# Altium project ESP32_PM.PrjPcb
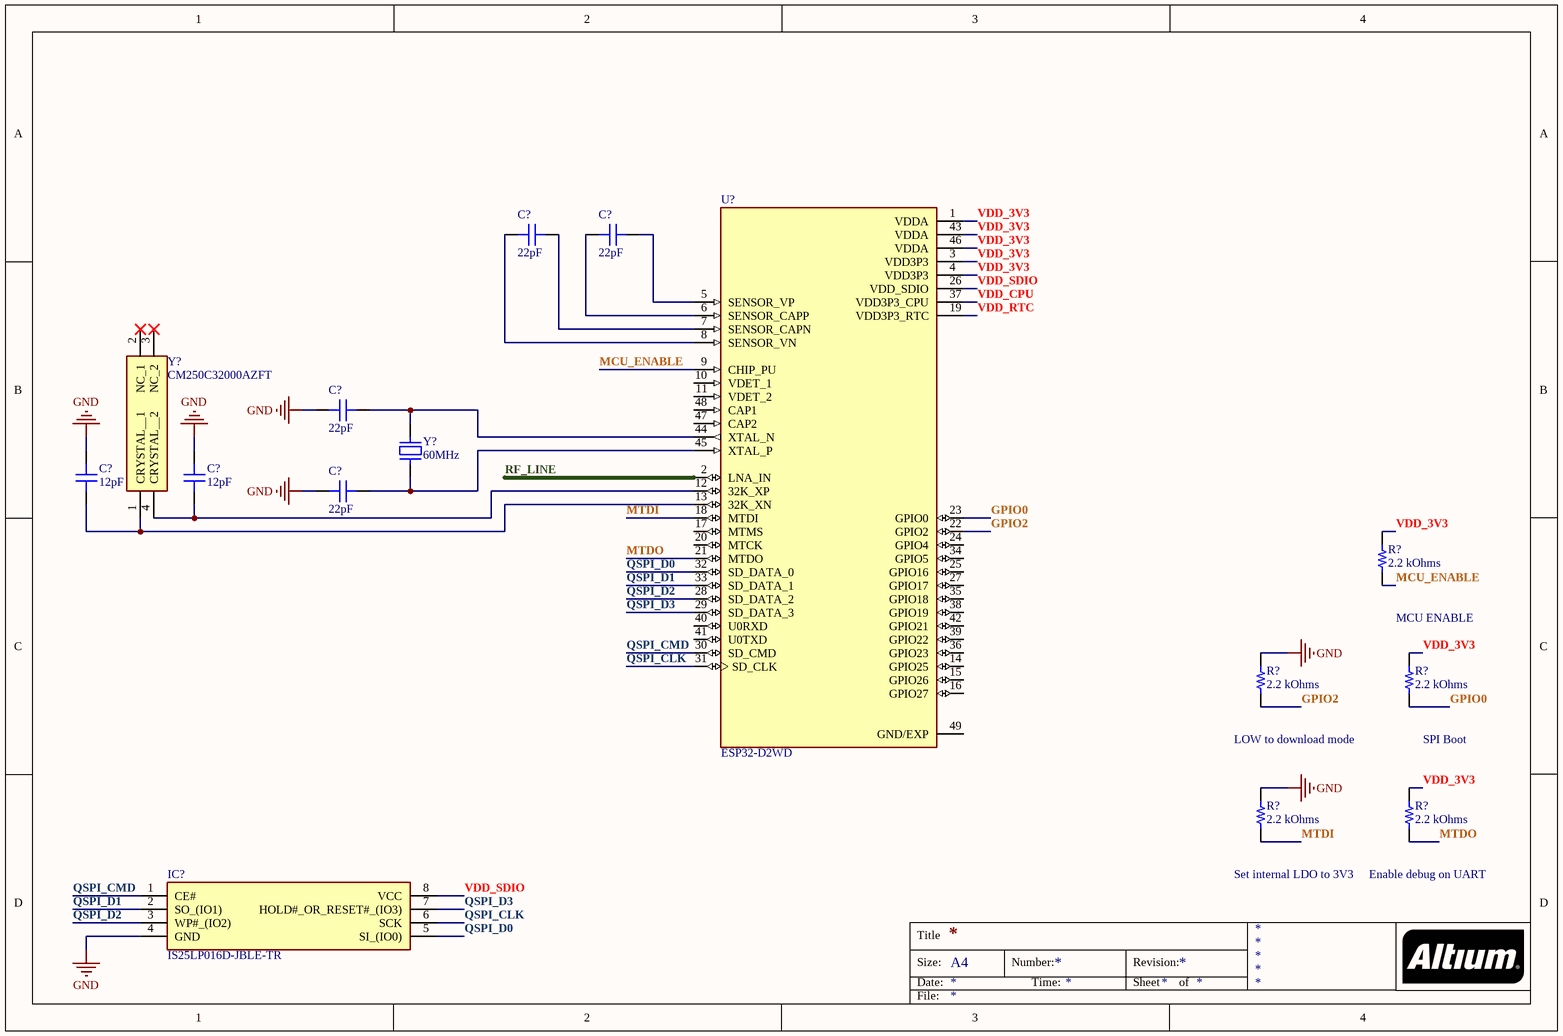
[diagram p0: Schematic.SchDoc]
Autor: Carlos Lecaro G.
1 sheet, 15 parts. Net scope: global (net labels, ports and power ports of the same name join across sheets).

## Sheet Schematic.SchDoc
size A4

### Parts
(Parts that share a designator on the sheet are numbered #1, #2 ... from top to bottom, then left to right.)
C?#1  22pF  [CAP 0603_1608]
C?#2  22pF  [CAP 0603_1608]
C?#3  22pF  [CAP 0603_1608]
C?#4  12pF  [CAP 0603_1608]
C?#5  12pF  [CAP 0603_1608]
C?#6  22pF  [CAP 0603_1608]
IC?  IS25LP016D-JBLE-TR  [SOIC127P790X216-8N]
R?#1  2.2 kOhms  [RES 0603_1608]
R?#2  2.2 kOhms  [RES 0603_1608]
R?#3  2.2 kOhms  [RES 0603_1608]
R?#4  2.2 kOhms  [RES 0603_1608]
R?#5  2.2 kOhms  [RES 0603_1608]
U?  ESP32-D2WD  [QFN35P500X500X90-49N]
Y?#1  60MHz  [TXC 9C]
Y?#2  CM250C32000AZFT  [CM250C32000AZFT]

### Nets
GND: C?#3.1 C?#4.2 C?#5.2 C?#6.1 IC?.4(GND) R?#2.2 R?#4.2
GPIO0: R?#3.1 U?.23(GPIO0)
GPIO2: R?#2.1 U?.22(GPIO2)
MCU_ENABLE: R?#1.1 U?.9(CHIP_PU)
MTDI: R?#4.1 U?.18(MTDI)
MTDO: R?#5.1 U?.21(MTDO)
QSPI_CLK: IC?.6(SCK) U?.31(SD_CLK)
QSPI_CMD: IC?.1(CE#) U?.30(SD_CMD)
QSPI_D0: IC?.5(SI_(IO0)) U?.32(SD_DATA_0)
QSPI_D1: IC?.2(SO_(IO1)) U?.33(SD_DATA_1)
QSPI_D2: IC?.3(WP#_(IO2)) U?.28(SD_DATA_2)
QSPI_D3: IC?.7(HOLD#_OR_RESET#_(IO3)) U?.29(SD_DATA_3)
RF_LINE: U?.2(LNA_IN)
VDD_3V3: R?#1.2 R?#3.2 R?#5.2 U?.1(VDDA) U?.3(VDD3P3) U?.4(VDD3P3) U?.43(VDDA) U?.46(VDDA)
VDD_CPU: U?.37(VDD3P3_CPU)
VDD_RTC: U?.19(VDD3P3_RTC)
VDD_SDIO: IC?.8(VCC) U?.26(VDD_SDIO)
NetC?#1_1: C?#1.1 U?.7(SENSOR_CAPN)
NetC?#1_2: C?#1.2 U?.8(SENSOR_VN)
NetC?#2_1: C?#2.1 U?.5(SENSOR_VP)
NetC?#2_2: C?#2.2 U?.6(SENSOR_CAPP)
NetC?#3_2: C?#3.2 U?.44(XTAL_N) Y?#1.2
NetC?#4_1: C?#4.1 U?.13(32K_XN) Y?#2.1(CRYSTAL__1)
NetC?#5_1: C?#5.1 U?.12(32K_XP) Y?#2.4(CRYSTAL__2)
NetC?#6_2: C?#6.2 U?.45(XTAL_P) Y?#1.1

Not connected (* = marked no-connect by the designer): U? 10(VDET_1) 11(VDET_2) 14(GPIO25) 15(GPIO26) 16(GPIO27) 17(MTMS) 20(MTCK) 24(GPIO4) 25(GPIO16) 27(GPIO17) 34(GPIO5) 35(GPIO18) 36(GPIO23) 38(GPIO19) 39(GPIO22) 40(U0RXD) 41(U0TXD) 42(GPIO21) 47(CAP2) 48(CAP1) 49(GND/EXP); Y?#2 2(NC_1)* 3(NC_2)*

### Notes on the sheet
- (near R?#3) MCU ENABLE
- (near R?#2) LOW to download mode
- (near R?#3) SPI Boot
- (near R?#4) Set internal LDO to 3V3
- (near R?#5) Enable debug on UART
- Title
- Size:
- Date:
- A4
- Number:
- Time:
- Revision:
- Sheet
- of
- File:

### Library data of the parts
C?#1-C?#3 C?#6 = 500X14N220MV4T: CAP CER 22PF 50V C0G/NP0 0603; Manufacturer: Johanson Dielectrics Inc.; Temperature Coefficient: C0G, NP0; Tolerance: ±20%; Part Number: 500X14N220MV4T; Value: 22pF; Applications: Bypass, Decoupling; Capacitance: 22pF; ComponentLink1Description: Datasheet; ComponentLink1URL: https://www.johansondielectrics.com/downloads/x2y-filter-and-decoupling-capacitors.pdf; ComponentLink2Description: DigiKey Link; ComponentLink2URL: http://digikey.com/product-detail/en/johanson-dielectrics-inc/500X14N220MV4T/709-1002-1-ND/1556407; Device Package: 0603 (1608 Metric); Features: Low ESL (X2Y); LastUpdated: 2/9/2020 1:03:03; Lifecycle Status: Active; Minimum Order: 1; Mounting Type: Surface Mount, MLCC; Operating Temperature: -55°C ~ 125°C; Package / Case: 0603 (1608 Metric); Packaging: TapeAndReel; PartId: 17447; Part Status: Active; Price: 0.08; Series: X2Y®; Size / Dimension: 0.064" L x 0.035" W (1.63mm x 0.89mm); Supplier 1: DigiKey; Supplier Part Number 1: 709-1002-1-ND; Thickness (Max): 0.026" (0.66mm); Voltage - Rated: 50V
C?#4 C?#5 = 251R14S120JV4T: CAP CER 12PF 250V C0G/NP0 0603; Manufacturer: Johanson Technology Inc.; Temperature Coefficient: C0G, NP0; Tolerance: ±5%; Part Number: 251R14S120JV4T; Value: 12pF; Applications: RF, Microwave, High Frequency; Capacitance: 12pF; ComponentLink1Description: Datasheet; ComponentLink1URL: https://www.johansontechnology.com/downloads/catalog/johanson-technology-multi-layer-high-q-capacitors.pdf; ComponentLink2Description: DigiKey Link; ComponentLink2URL: http://digikey.com/product-detail/en/johanson-technology-inc/251R14S120JV4T/712-1314-1-ND/1786776; Device Package: 0603 (1608 Metric); Features: High Q, Low Loss, Ultra Low ESR; LastUpdated: 2/9/2020 1:03:22; Lifecycle Status: Active; Minimum Order: 1; Mounting Type: Surface Mount, MLCC; Operating Temperature: -55°C ~ 125°C; Package / Case: 0603 (1608 Metric); Packaging: TapeAndReel; PartId: 10205; Part Status: Active; Price: 0.07; Series: S; Size / Dimension: 0.062" L x 0.032" W (1.57mm x 0.81mm); Supplier 1: DigiKey; Supplier Part Number 1: 712-1314-1-ND; Thickness (Max): 0.035" (0.89mm); Voltage - Rated: 250V
IC? = IS25LP016D-JBLE-TR: Integrated Circuit; Manufacturer_Name: Integrated Silicon Solution Inc.; Datasheet Link: http://www.issi.com/WW/pdf/25LP-WP016D.pdf; Height: 2.16mm; Manufacturer_Part_Number: IS25LP016D-JBLE-TR; Mouser Part Number: 870-IS25LP016DJBLETR; Mouser Price/Stock: https://www.mouser.co.uk/ProductDetail/ISSI/IS25LP016D-JBLE-TR?qs=DXv0QSHKF4wuflNQCaasOQ%3D%3D; Arrow Part Number: IS25LP016D-JBLE-TR; Arrow Price/Stock: https://www.arrow.com/en/products/is25lp016d-jble-tr/integrated-silicon-solution-inc
R?#1-R?#5 = PTN0603E2201BST1: RES 2.2K OHM 0.1% 0.15W 0603; Manufacturer: Vishay Thin Film; Temperature Coefficient: ±25ppm/°C; Part Number: PTN0603E2201BST1; Value: 2.2 kOhms; ComponentLink1Description: Datasheet; ComponentLink1URL: http://www.vishay.com/docs/60026/ptn.pdf; ComponentLink2Description: DigiKey Link; ComponentLink2URL: http://digikey.com/product-detail/en/vishay-thin-film/PTN0603E2201BST1/764-1403-1-ND/7103187; Composition: Thin Film; Device Package: 0603 (1608 Metric); Features: Anti-Sulfur, Moisture Resistant, Non-Inductive; Height - Seated (Max): 0.020" (0.51mm); LastUpdated: 2/9/2020 1:09:46; Lifecycle Status: Active; Minimum Order: 1; Number of Terminations: 2; Operating Temperature: -55°C ~ 155°C; Package / Case: 0603 (1608 Metric); Packaging: TapeAndReel; PartId: 22531; Part Status: Active; Power (Watts): 0.15W; Price: 0.21; Resistance: 2.2 kOhms; Series: PTN; Size / Dimension: 0.064" L x 0.032" W (1.63mm x 0.81mm); Supplier 1: DigiKey; Supplier Part Number 1: 764-1403-1-ND; Supplier Device Package: 0603; Tolerance: ±0.1%
U? = ESP32-D2WD: IC RF TxRx + MCU Bluetooth, WiFi 802.11b/g/n, Bluetooth 4.2 2.4GHz 48-VFQFN Exposed Pad; MF: Espressif Systems; Package: VFQFN-48 Espressif Systems; Value: *; Availability: Unavailable; SnapEDA_Link: https://www.snapeda.com/parts/ESP32-D2WD/Espressif%20Systems/view-part/2291394/?ref=snap; Price: None; MP: ESP32-D2WD
Y?#1 = 9C-60.000MBBK-T: CRYSTAL 60.0000MHZ 20PF SMD; Manufacturer: TXC CORPORATION; ESR (Equivalent Series Resistance): 60 Ohms; Frequency Stability: ±50ppm; Operating Mode: 3rd Overtone; Part Number: 9C-60.000MBBK-T; ComponentLink1Description: Datasheet; ComponentLink1URL: http://www.txccorp.com/download/products/quartz_crystals/2015TXC_9C_32.pdf; ComponentLink2Description: DigiKey Link; ComponentLink2URL: http://digikey.com/product-detail/en/txc-corporation/9C-60.000MBBK-T/887-1952-1-ND/3679684; Frequency: 60MHz; Frequency Tolerance: ±50ppm; Height - Seated (Max): 0.161" (4.10mm); LastUpdated: 2/9/2020 1:22:01; Lifecycle Status: Active; Load Capacitance: 20pF; Minimum Order: 1; Mounting Type: Surface Mount; Operating Temperature: -20°C ~ 70°C; Package / Case: HC-49S; Packaging: TapeAndReel; PartId: 692; Part Status: Active; Price: 0.24; Series: 9C; Size / Dimension: 0.449" L x 0.189" W (11.40mm x 4.80mm); Supplier 1: DigiKey; Supplier Part Number 1: 887-1952-1-ND; Type: MHz Crystal; Value: 60MHz
Y?#2 = CM250C32000AZFT: Crystal or Oscillator; Manufacturer_Name: Citizen Finetech Miyota; Datasheet Link: http://cfd.citizen.co.jp/english/prod-tech/product/pdf/datasheet_TF/CM200C_CM250C_E.pdf; Height: 2.5mm; Manufacturer_Part_Number: CM250C32000AZFT; Mouser Part Number: 695-CM250C-32K-U; Mouser Price/Stock: https://www.mouser.co.uk/ProductDetail/Citizen-FineDevice/CM250C32000AZFT?qs=byeeYqUIh0POrNkRB%252B9Ckg%3D%3D